# Altium schematic sheet Sheet_1_2024-09-09.schdoc
size 603 x 238 mm
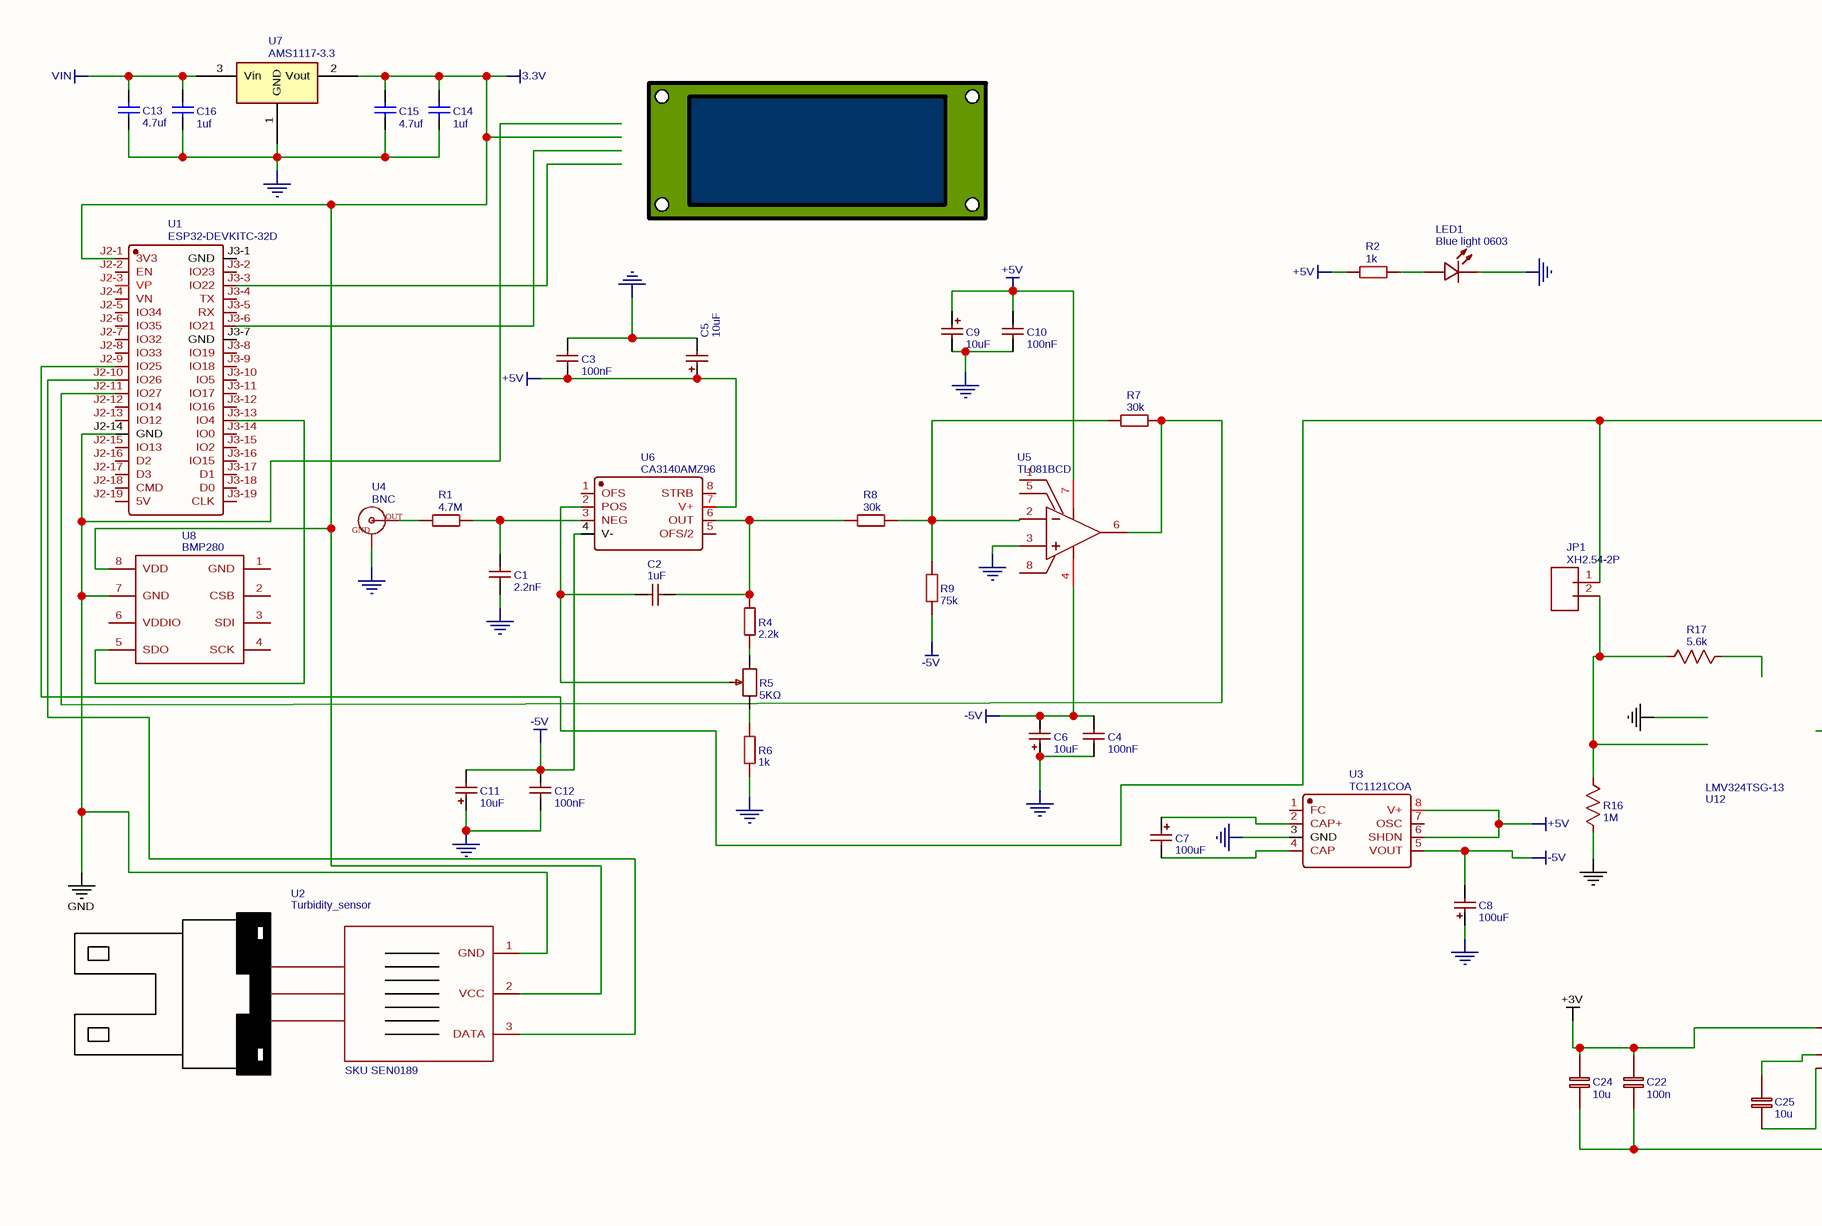
[diagram p0: Sheet_1_2024-09-09.schdoc, left]
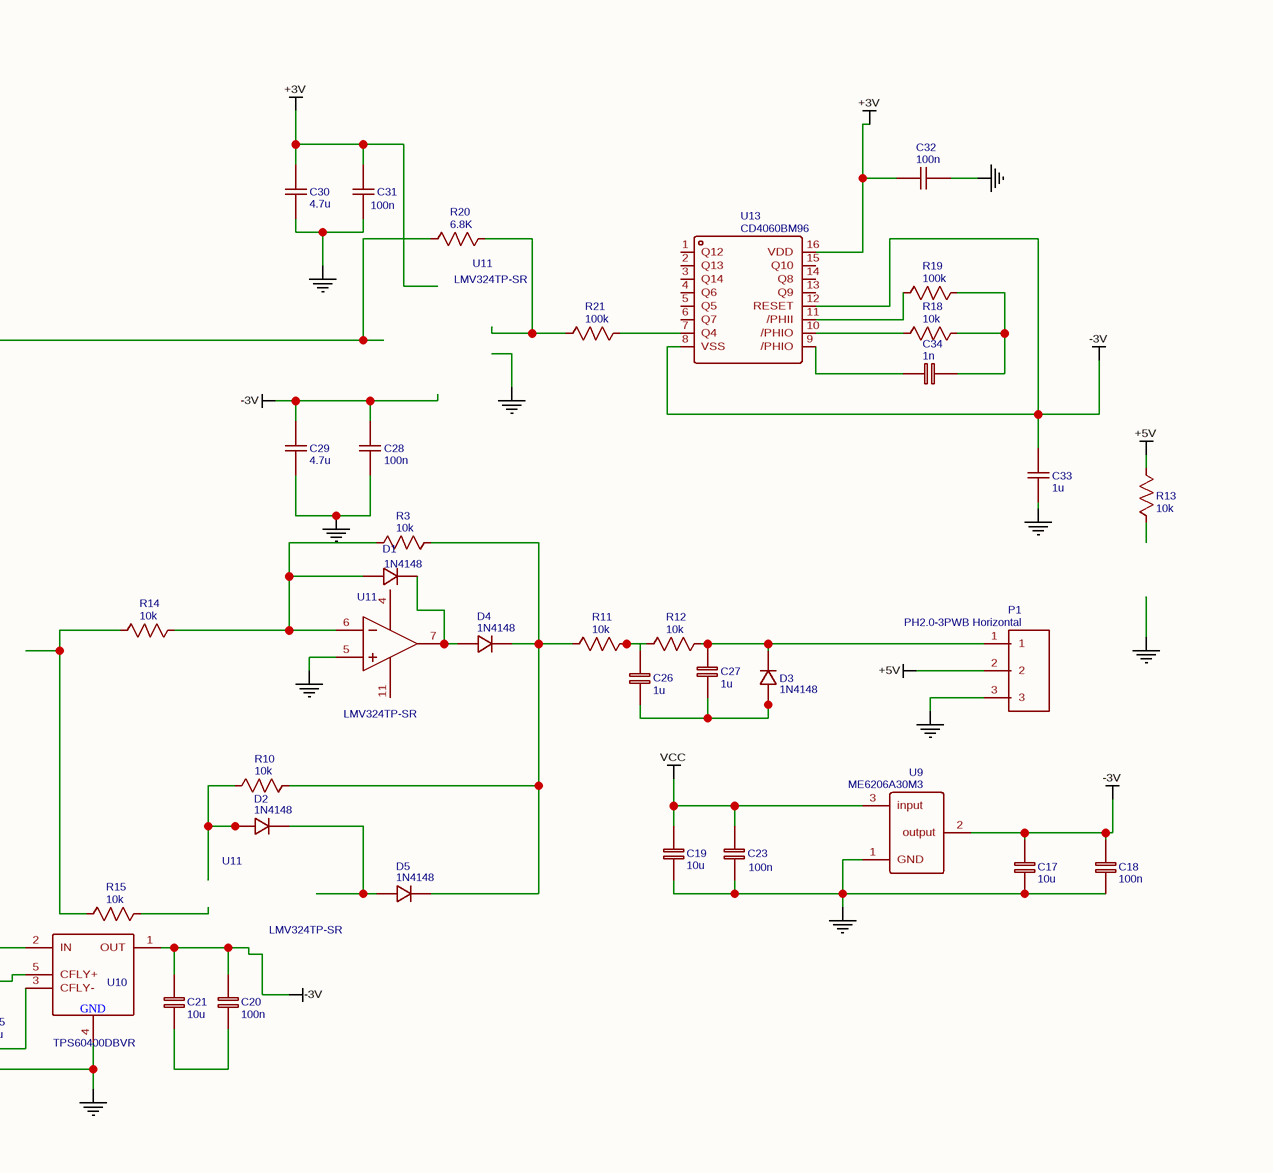
[diagram p1: Sheet_1_2024-09-09.schdoc, right]

## Parts
(Parts that share a designator on the sheet are numbered #1, #2 ... from top to bottom, then left to right.)
C1  2.2nF  [0603]
C2  1uF  [0603]
C3  100nF  [0603]
C4  100nF  [0603]
C5  10uF  [CASE-A_3216]
C6  10uF  [CASE-A_3216]
C7  100uF  [CASE-B_3528]
C8  100uF  [CASE-B_3528]
C9  10uF  [CASE-A_3216]
C10  100nF  [0603]
C11  10uF  [CASE-A_3216]
C12  100nF  [0603]
C13  4.7uf  [C1206]
C14  1uf  [C-0603]
C15  4.7uf  [C1206]
C16  1uf  [C-0603]
C17  10u  [RAD-0.1]
C18  100n  [RAD-0.1]
C19  10u  [RAD-0.1]
C20  100n  [RAD-0.1]
C21  10u  [RAD-0.1]
C22  100n  [RAD-0.1]
C23  100n  [RAD-0.1]
C24  10u  [RAD-0.1]
C25  10u  [RAD-0.1]
C26  1u  [RAD-0.1]
C27  1u  [RAD-0.1]
C28  100n  [RAD-0.1]
C29  4.7u  [RAD-0.1]
C30  4.7u  [RAD-0.1]
C31  100n  [RAD-0.1]
C32  100n  [RAD-0.1]
C33  1u  [RAD-0.1]
C34  1n  [RAD-0.1]
D1  1N4148  [DO-35G]
D2  1N4148  [DO-35G]
D3  1N4148  [DO-35G]
D4  1N4148  [DO-35G]
D5  1N4148  [DO-35G]
JP1  XH2.54-2P  [XH2.54-2P]
LED1  Blue light 0603  [0603]
P1  PH2.0-3PWB Horizontal  [PH-3PWB]
R1  4.7M  [AXIAL-0.3]
R2  1k  [AXIAL-0.3]
R3  10k  [AXIAL-0.3]
R4  2.2k  [AXIAL-0.3]
R5  5KΩ  [RES-ADJ_3296W]
R6  1k  [AXIAL-0.3]
R7  30k  [AXIAL-0.3]
R8  30k  [AXIAL-0.3]
R9  75k  [AXIAL-0.3]
R10  10k  [AXIAL-0.3]
R11  10k  [AXIAL-0.3]
R12  10k  [AXIAL-0.3]
R13  10k  [AXIAL-0.3]
R14  10k  [AXIAL-0.3]
R15  10k  [AXIAL-0.3]
R16  1M  [AXIAL-0.3]
R17  5.6k  [AXIAL-0.3]
R18  10k  [AXIAL-0.3]
R19  100k  [AXIAL-0.3]
R20  6.8K  [AXIAL-0.3]
R21  100k  [AXIAL-0.3]
U1  ESP32-DEVKITC-32D  [COMM-SMD_ESP32-DEVKITC-32D]
U2  Turbidity_sensor  [TURBIDITY_SENSOR]
U3  TC1121COA  [SOIC-8]
U4  BNC  [BNC]
U5  TL081BCD  [SOIC8]
U6  CA3140AMZ96  [SOIC-8_150MIL]
U7  AMS1117-3.3  [SOT223]
U8  BMP280  [LGA-8_L2.5-W2.0-P0.65_AMP6127]
U9  ME6206A30M3  [SOT-23(SOT-23-3)]
U10  TPS60400DBVR  [SOT-23-5]
U11#1  LMV324TP-SR  [SOIC-14_150MIL]
U11#2  LMV324TP-SR  [SOIC-14_150MIL]
U11#3  LMV324TP-SR  [SOIC-14_150MIL]
U12  LMV324TSG-13  [TSSOP-14]
U13  CD4060BM96  [SOIC-16_150MIL]

## Nets
3.3V: C14.2 C15.2 U1.J2-1(3V3) U2.2(VCC) U7.2(Vout) U8.8(VDD)
+3V: C22.2 C24.2 C30.2 C31.2 C32.1 U10.2(IN) U13.16(VDD)
+5V: C3.1 C5.1 C9.1 C10.2 P1.2 R2.1 R13.2 U3.6(SHDN) U3.8(V+) U5.7(VCC+) U6.7(V+)
-3V: C17.2 C18.2 C20.2 C21.2 C28.2 C29.2 C33.2 U9.2(output) U10.1(OUT) U13.8(VSS) U13.12(RESET)
-5V: C4.2 C6.2 C8.2 C11.2 C12.2 R9.1 U3.5(VOUT) U5.4(VCC-) U6.4(V-)
GND: C1.1 C3.2 C4.1 C5.2 C6.1 C8.1 C9.2 C10.1 C11.1 C12.1 C13.1 C14.1 C15.1 C16.1 C17.1 C18.1 C19.1 C22.1 C23.1 C24.1 C28.1 C29.1 C30.1 C31.1 C32.2 C33.1 LED1.1(K) P1.3 R6.1 R16.2 U1.J2-14(GND) U2.1(GND) U3.3(GND) U4.GND U5.3(IN+) U7.1(GND) U8.7(GND) U9.1(GND) U10.4(GND) U11#2.5(INB+)
VCC: C19.2 C23.2 U9.3(input)
VIN: C13.2 C16.2 U7.3(Vin)
NetC1_2: C1.2 R1.2 U6.3(NEG)
NetC2_1: C2.1 R5.2 U6.2(POS)
NetC2_2: C2.2 R4.2 R8.1 U6.6(OUT)
NetC7_1: C7.1 U3.2(CAP+)
NetC7_2: C7.2 U3.4(CAP)
NetC20_1: C20.1 C21.1
NetC25_1: C25.1 U10.3(CFLY-)
NetC25_2: C25.2 U10.5(CFLY+)
NetC26_1: C26.1 C27.1 D3.1
NetC26_2: C26.2 R11.2 R12.1
NetC27_2: C27.2 D3.2 P1.1 R12.2
NetC34_1: C34.1 U13.9(/PHIO)
NetC34_2: C34.2 R18.2 R19.2
NetD1_1: D1.1 R3.1 R14.2 U11#2.6(INB-)
NetD1_2: D1.2 D4.1 U11#2.7(OUTB)
NetD2_1: D2.1 R10.1
NetD2_2: D2.2 D5.1
NetD4_2: D4.2 D5.2 R3.2 R10.2 R11.1
NetJP1_1: JP1.1 R20.1 U1.J2-9(IO25)
NetJP1_2: JP1.2 R16.1 R17.1
NetLED1_2: LED1.2(A) R2.2
NetR1_1: R1.1 U4.S(OUT)
NetR4_1: R4.1 R5.1
NetR5_3: R5.3 R6.2
NetR7_1: R7.1 R8.2 R9.2 U5.2(IN-)
NetR7_2: R7.2 U1.J2-11(IO27) U5.6(OUT)
NetR14_1: R14.1 R15.1
NetR18_1: R18.1 U13.10(/PHIO)
NetR19_1: R19.1 U13.11(/PHII)
NetR20_2: R20.2 R21.1
NetR21_2: R21.2 U13.7(Q4)
NetU1_J2-10: U1.J2-10(IO26) U2.3(DATA)
NetU1_J3-13: U1.J3-13(IO4) U8.5(SDO)

Not connected (* = marked no-connect by the designer): R13 1; R15 2; R17 2; U1 J2-2(EN) J2-3(VP) J2-4(VN) J2-5(IO34) J2-6(IO35) J2-7(IO32) J2-8(IO33) J2-12(IO14) J2-13(IO12) J2-15(IO13) J2-16(D2) J2-17(D3) J2-18(CMD) J2-19(5V) J3-1(GND) J3-2(IO23) J3-3(IO22) J3-4(TX) J3-5(RX) J3-6(IO21) J3-7(GND) J3-8(IO19) J3-9(IO18) J3-10(IO5) J3-11(IO17) J3-12(IO16) J3-14(IO0) J3-15(IO2) J3-16(IO15) J3-17(D1) J3-18(D0) J3-19(CLK); U3 1(FC) 7(OSC); U5 1(OFFSET_N1) 5(OFFSET_N2) 8(NC); U6 1(OFS) 5(OFS/2) 8(STRB); U8 1(GND) 2(CSB) 3(SDI) 4(SCK) 6(VDDIO); U11#2 4(V+) 11(V-); U13 1(Q12) 2(Q13) 3(Q14) 4(Q6) 5(Q5) 6(Q7) 13(Q9) 14(Q8) 15(Q10)

## Library data of the parts
C1 = 2.2nF: Manufacturer Part: CL10C222JB8NNNC; Manufacturer: SAMSUNG; nameAlias: Capacitance; Tolerance: ±5%; Supplier: LCSC; LCSC: C33353; spicePre: C; spiceSymbolName: CL10C222JB8NNNC
C2 = 1uF: Manufacturer: YAGEO; Manufacturer Part: CC0603KRX7R7BB105; nameAlias: Capacitance; Tolerance: ±10%; Rated Voltage: 16V; Supplier: LCSC; LCSC: C106248; spicePre: C; spiceSymbolName: CC0603KRX7R7BB105
C3 C4 C10 C12 = 100nF: Manufacturer: YAGEO; Manufacturer Part: CC0603KRX7R8BB104; nameAlias: Capacitance; Tolerance: ±10%; Rated Voltage: 25V; Supplier: LCSC; LCSC: C92490; spicePre: C; spiceSymbolName: CC0603KRX7R8BB104
C5 C6 C9 C11 = 10uF: Manufacturer: CEC; Manufacturer Part: CA45-A-16V-10uF-K; Supplier: LCSC; LCSC: C128254; Operating Temperature: -55℃
C7 C8 = 100uF: Manufacturer: Xiangyee; Manufacturer Part: CA45-B010K107T; nameAlias: Capacitance; Supplier: LCSC; LCSC: C122644; Operating Temperature: -55℃
C13 C15 = 4.7uf: catid: 20; description: Capacitor; sourceId: aYgasJ1jB; timeStamp: 1452930407; Manufacturer Part: ?; spicePre: C
C14 C16 = 1uf: catid: 20; description: Capacitor; sourceId: aYgasJ1jB; timeStamp: 1452930407; Manufacturer Part: ?; spicePre: C
C17 C19 C21 C24 C25 = 10u: nameAlias: Value(F); Manufacturer Part: ?; spicePre: C; spiceSymbolName: Cap_RAD-0.1_EU
C18 C20 C22 C23 C28 C31 C32 = 100n: nameAlias: Value(F); Manufacturer Part: ?; spicePre: C
  C18 C20 C22 C23: spiceSymbolName: Cap_RAD-0.1_EU
  C28 C31 C32: spiceSymbolName: Cap_RAD-0.1_US
C26 C27 C33 = 1u: nameAlias: Value(F); Manufacturer Part: ?; spicePre: C
  C26 C27: spiceSymbolName: Cap_RAD-0.1_EU
  C33: spiceSymbolName: Cap_RAD-0.1_US
C29 C30 = 4.7u: nameAlias: Value(F); Manufacturer Part: ?; spicePre: C; spiceSymbolName: Cap_RAD-0.1_US
C34 = 1n: nameAlias: Value(F); Manufacturer Part: ?; spicePre: C; spiceSymbolName: Cap_RAD-0.1_EU
D1-D5 = 1N4148: Manufacturer: FMS; Contributor: LCSC; Supplier Part: C163750; Supplier: LCSC; Manufacturer Part: 1N4148; spicePre: D
JP1 = XH2.54-2P: Contributor: 584992092; Manufacturer Part: ?; Supplier Part: undefined; spicePre: J
LED1 = Blue light 0603: Manufacturer: KENTO; Supplier: LCSC; Manufacturer Part: Blue light 0603; LCSC: C2288; image: //image.lceda.cn/szlcsc/C2288.jpg; spicePre: L
P1 = PH2.0-3PWB Horizontal: Manufacturer: BOOMELE; Supplier: LCSC; Manufacturer Part: PH2.0-3PWB Horizontal; image: //image.lceda.cn/szlcsc/C81626.jpg; Supplier Part: C81626; spicePre: P
R1 = 4.7M: nameAlias: Value(Ω); Manufacturer Part: ?; spicePre: R; spiceSymbolName: Resistor
R2 R6 = 1k: nameAlias: Value(Ω); Manufacturer Part: ?; spicePre: R; spiceSymbolName: Resistor
R3 R10-R15 R18 = 10k: nameAlias: Value(Ω); Manufacturer Part: ?; spicePre: R; spiceSymbolName: Res_AXIAL-0.3(1/8W)_US
R4 = 2.2k: nameAlias: Value(Ω); Manufacturer Part: ?; spicePre: R; spiceSymbolName: Resistor
R5 = 5KΩ: Manufacturer: Bochen; Manufacturer Part: 3296W-1-502LF_C118907; nameAlias: Value; Tolerance: ±10%; Supplier: LCSC; LCSC: C118907; spicePre: R; spiceSymbolName: 3296W-1-502LF_C118907
R7 R8 = 30k: nameAlias: Value(Ω); Manufacturer Part: ?; spicePre: R; spiceSymbolName: Resistor
R9 = 75k: nameAlias: Value(Ω); Manufacturer Part: ?; spicePre: R; spiceSymbolName: Resistor
R16 = 1M: nameAlias: Value(Ω); Manufacturer Part: ?; spicePre: R; spiceSymbolName: Res_AXIAL-0.3(1/8W)_US
R17 = 5.6k: nameAlias: Value(Ω); Manufacturer Part: ?; spicePre: R; spiceSymbolName: Res_AXIAL-0.3(1/8W)_US
R19 R21 = 100k: nameAlias: Value(Ω); Manufacturer Part: ?; spicePre: R; spiceSymbolName: Res_AXIAL-0.3(1/8W)_US
R20 = 6.8K: nameAlias: Value(Ω); Manufacturer Part: ?; spicePre: R; spiceSymbolName: Res_AXIAL-0.3(1/8W)_US
U1 = ESP32-DEVKITC-32D: Manufacturer: ESPRESSIF(乐鑫); Contributor: lcsc; Supplier: LCSC; Supplier Part: C571181; Manufacturer Part: ESP32-DevKitC-32D; JLCPCB Part Class: Extended Part; spicePre: U; spiceSymbolName: ESP32-DEVKITC-32D
U2 = Turbidity_sensor: Manufacturer: DFROBOT; Manufacturer Part: SKU SEN0189; Contributor: cbarriosm3; Supplier: DFROBOT; Supplier Part: SKU SEN0189; link: https://wiki.dfrobot.com/Turbidity_sensor_SKU__SEN0189; spicePre: U; spiceSymbolName: Turbidity_sensor_SKU_SEN0189
U4 = BNC: Contributor: SparkFun; Manufacturer Part: ?; spicePre: U
U5 = TL081BCD: description: JFET-Input Operational Amplifier, 7 to 36 V, 0 to 70 degC, 8-pin SOIC (D8), Green (RoHS  no SbBr); Manufacturer Part: ?; spicePre: U
U6 = CA3140AMZ96: Manufacturer: Intersil; Supplier: LCSC; Manufacturer Part: CA3140AMZ96; LCSC: C31540; image: //image.lceda.cn/szlcsc/C31540.jpg; spicePre: U
U7 = AMS1117-3.3: catid: 20; sourceId: 0Q2ZvNHZv; timeStamp: 1452930407; Manufacturer Part: ?; spicePre: U
U8 = BMP280: Manufacturer: Bosch(博世); Supplier: LCSC; Manufacturer Part: BMP280; Supplier Part: C83291; JLCPCB Part Class: Extended Part; spicePre: U; spiceSymbolName: BMP280
U9 = ME6206A30M3: Manufacturer: MICRONE; Supplier: LCSC; Manufacturer Part: ME6206A30M3; image: //image.lceda.cn/szlcsc/C78994.jpg; Supplier Part: C78994; spicePre: U
U10 = TPS60400DBVR: Manufacturer: TI; Supplier: LCSC; Manufacturer Part: TPS60400DBVR; image: //image.lceda.cn/szlcsc/C9839.jpg; Supplier Part: C9839; spicePre: U
U11#1 = LMV324TP-SR: Manufacturer Part: 3PEAK; subpart_no: 4; Supplier Part: C90298; Supplier: LCSC; Manufacturer: LMV324TP-SR; spicePre: U
U11#2 = LMV324TP-SR: Manufacturer Part: 3PEAK; subpart_no: 1; Supplier Part: C90298; Supplier: LCSC; Manufacturer: LMV324TP-SR; spicePre: U
U11#3 = LMV324TP-SR: Manufacturer Part: 3PEAK; subpart_no: 3; Supplier Part: C90298; Supplier: LCSC; Manufacturer: LMV324TP-SR; spicePre: U
U12 = LMV324TSG-13: Manufacturer: DIODES; subpart_no: 3; Value: LMV324TSG-13; Supplier Part: C150712; Supplier: LCSC; Manufacturer Part: LMV324TSG-13; spicePre: U
U13 = CD4060BM96: Manufacturer: TI; Supplier: LCSC; Manufacturer Part: CD4060BM96; image: //image.lceda.cn/szlcsc/C32699.jpg; Supplier Part: C32699; spicePre: U
U3 = TC1121COA: spicePre: X; Manufacturer Part: ?